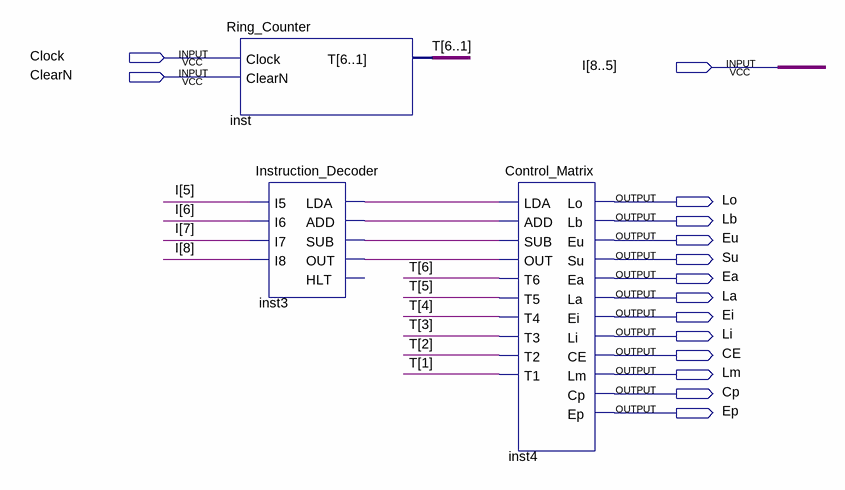
[diagram p0: schematic sheet]
// Quartus schematic Controlador_Sequencializador.bdf as structural Verilog: 3 symbols, 15 pins
module Controlador_Sequencializador (
  input  Clock,
  input  [8:5] I,
  input  ClearN,
  output Lo,
  output Lb,
  output Eu,
  output Su,
  output Ea,
  output La,
  output Ei,
  output Li,
  output CE,
  output Lm,
  output Cp,
  output Ep
);

  wire inst3_add, inst3_lda, inst3_out, inst3_sub;
  wire [6:1] T;

  Ring_Counter inst (.T(T));  // open: Clock, ClearN
  Instruction_Decoder inst3 (
    .I5(I[5]), .I6(I[6]), .I7(I[7]), .I8(I[8]), .LDA(inst3_lda), .ADD(inst3_add), .SUB(inst3_sub),
    .OUT(inst3_out));  // open: HLT
  Control_Matrix inst4 (
    .LDA(inst3_lda), .ADD(inst3_add), .SUB(inst3_sub), .OUT(inst3_out), .T6(T[6]), .T5(T[5]), .T4(T[4]),
    .T3(T[3]), .T2(T[2]), .T1(T[1]), .Lo(Lo), .Lb(Lb), .Eu(Eu), .Su(Su), .Ea(Ea), .La(La), .Ei(Ei), .Li(Li),
    .CE(CE), .Lm(Lm), .Cp(Cp), .Ep(Ep));
endmodule
